# Altium schematic sheet CAN Address Switch Array.SchDoc
size A
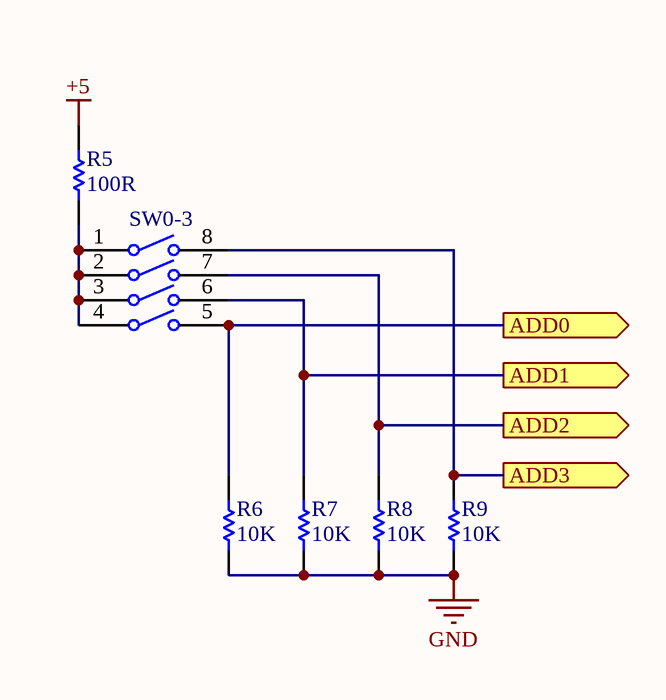
[diagram p0: CAN Address Switch Array.SchDoc]

## Parts
R5  100R  [RESC0805(2012)_L]
R6  10K  [RESC0805(2012)_M]
R7  10K  [RESC0805(2012)_M]
R8  10K  [RESC0805(2012)_M]
R9  10K  [RESC0805(2012)_M]
SW0-3  TDA04H0SB1  [CKCP-TDA04H0SB1R_V]  (value not drawn)

## Ports
ADD0 (out), ADD1 (out), ADD2 (out), ADD3 (out)

## Nets
+5: R5.2
GND: R6.1 R7.1 R8.1 R9.1
ADD0: R6.2 SW0-3.5 ; port ADD0
ADD1: R7.2 SW0-3.6 ; port ADD1
ADD2: R8.2 SW0-3.7 ; port ADD2
ADD3: R9.2 SW0-3.8 ; port ADD3
NetR5_1: R5.1 SW0-3.1 SW0-3.2 SW0-3.3 SW0-3.4

## Library data of the parts
R5 = CMP-1013-00397-1: 100R 0.125W 1% 0805 (2012 Metric)  SMD; Value: 100.00 Ohm; Case-Metric: 2012; Case-EIA: 0805; Technology: SMT; Power: 0.125 W; Tolerance: 1 %
R6-R9 = CMP-1013-00510-1: 1K 0.125W 1% 0805 (2012 Metric)  SMD; Case-Metric: 2012; Value: 1000.00 Ohm; Case-EIA: 0805; Tolerance: 1 %; Power: 0.125 W; Technology: SMT
SW0-3 = SMD Half-Pitch Dip Switch Array: Ultra-Miniature Surface Mount Half-Pitch DIP Switch, 25 mA, 24 V, -40 to 85 degC, 8-Pin SMD, RoHS, Tube; Contact Current Rating: 100 mA; Throw Configuration: SPST; Voltage Rating (DC): 24 V; Max Contact Resistance: 100 mohm; Max Current Rating: 25 mA; REACH SVHC: No SVHC; DatasheetVersion: 02/2016; Case\Package: DIP; Package Quantity: 70; Lead Pitch: 1.27 mm; Contact Plating: Gold; Packaging: Rail/Tube; Contact Finish: Gold; Mount: Surface Mount; Height: 2.3 mm; Contact Material: Copper; Max Operating Temperature: 85 degC; Max Voltage Rating (DC): 24 V; ComponentLink1URL: http://www.ck-components.com/media/1328/tda.pdf; PackageDescription: 8-Pin Surface Mount Device, Body 6.21 x 6.2 mm, Pitch 1.27 mm; Radiation Hardening: No; ComponentLink1Description: Datasheet; Current Rating: 100 mA; RoHSCompliant: true; PackageReference: TDA04H0SB1R; Min Operating Temperature: -40 degC; Pins: 4; Mounting Technology: Surface Mount; Length: 6.21 mm